# EAGLE schematic HDMI-LVDS (EAGLE 7.6.0)

## Sheet 1 of 3
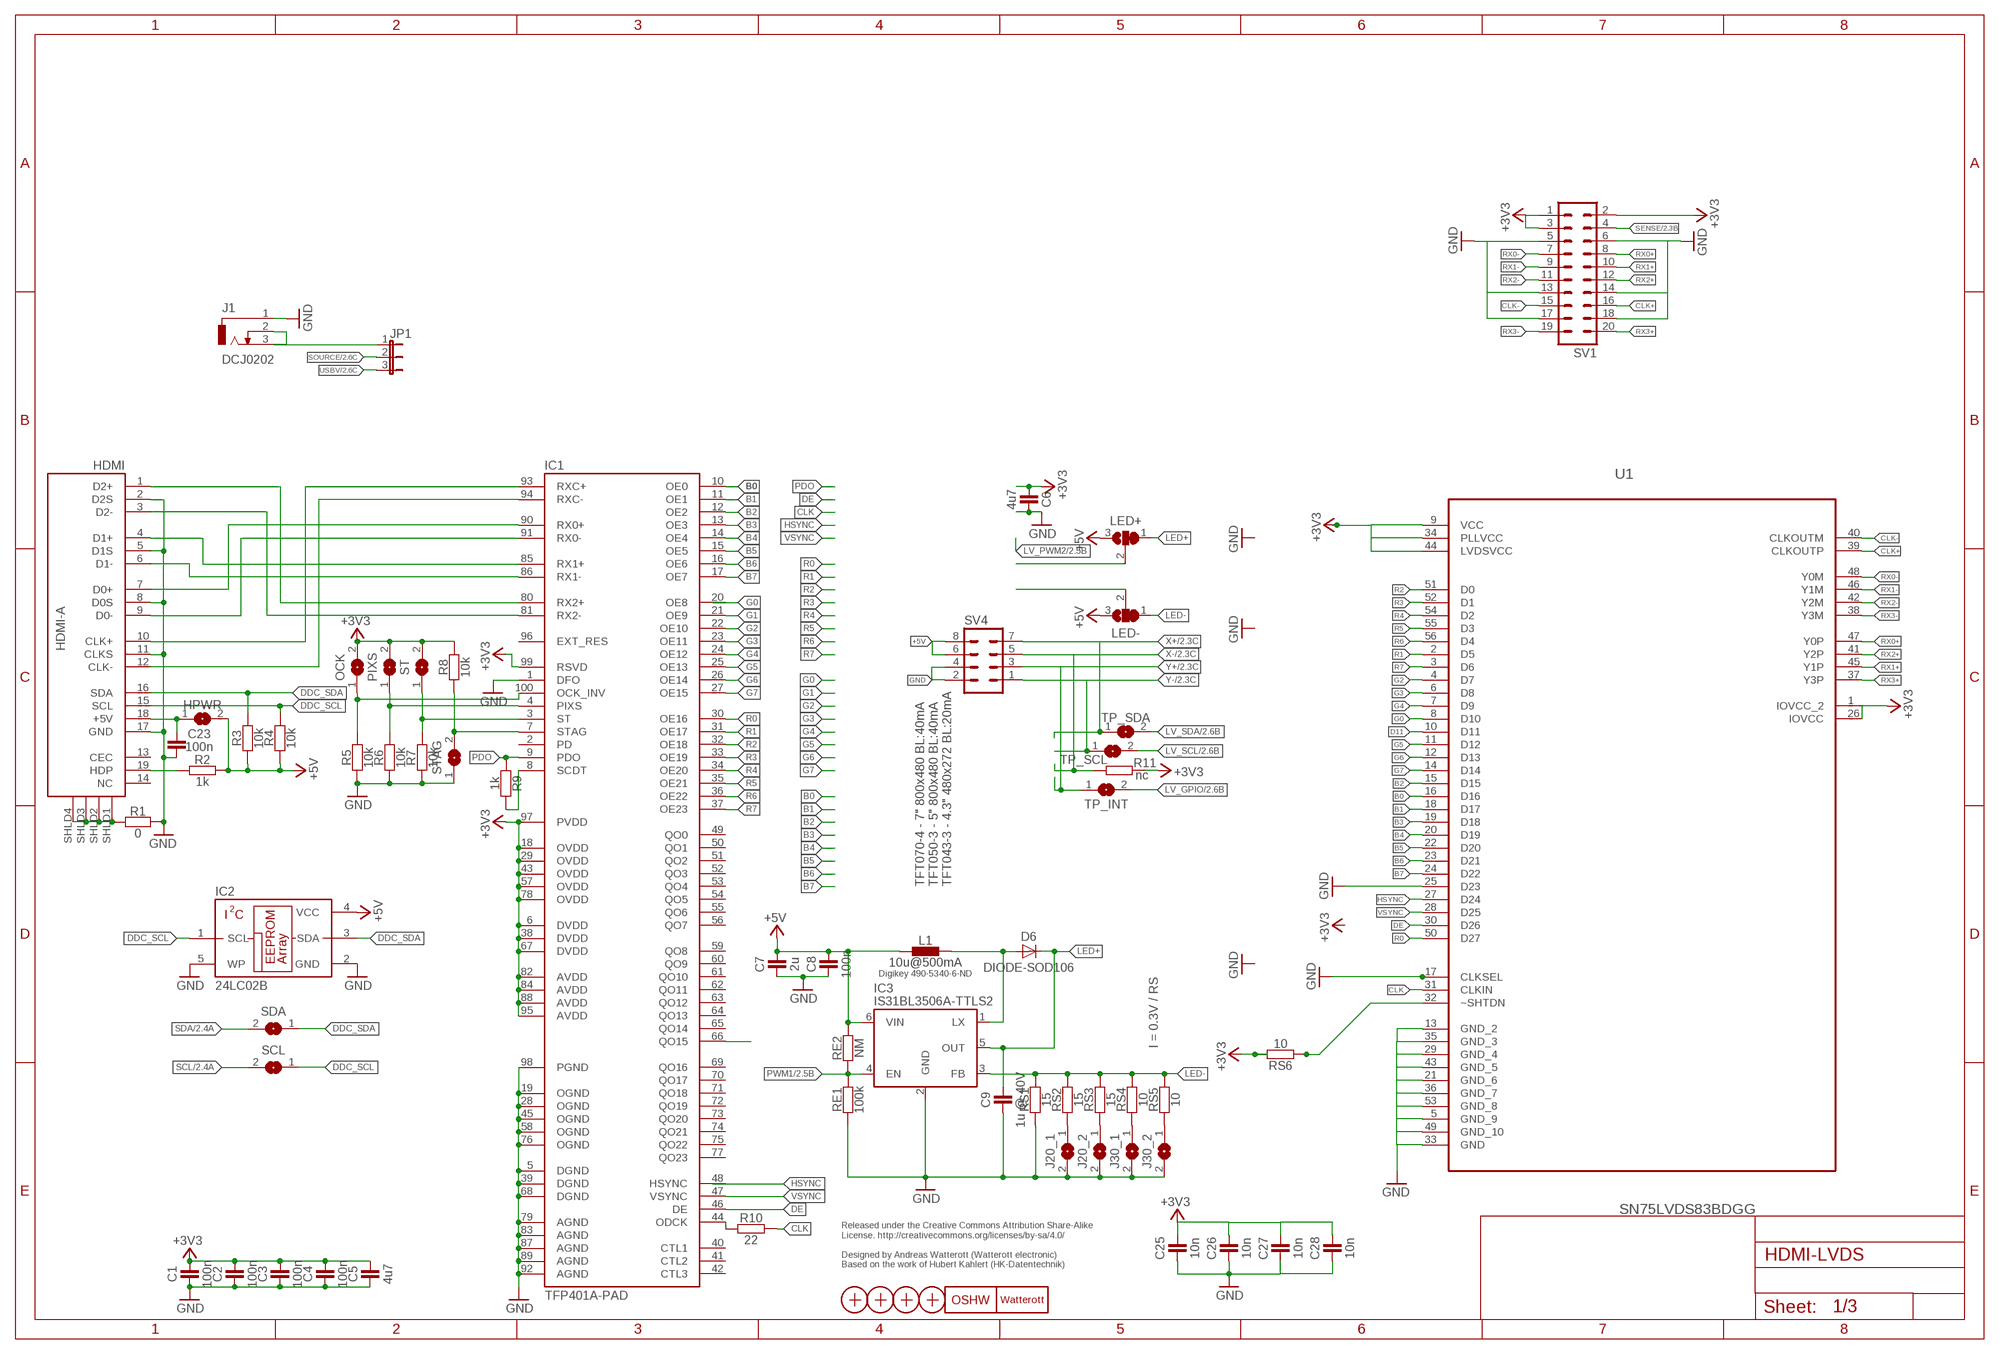
[diagram p0: schematic, sheet 1]

### Parts
C1  100n  CAPACITOR-0402  [C0402]
C2  100n  CAPACITOR-0402  [C0402]
C3  100n  CAPACITOR-0402  [C0402]
C4  100n  CAPACITOR-0402  [C0402]
C5  4u7  CAPACITOR-0402  [C0402]
C6  4u7  CAPACITOR-0402  [C0402]
C7  2u  CAPACITOR-0402  [C0402]
C8  100n  CAPACITOR-0402  [C0402]
C9  1u @ 40V  CAPACITOR-0805  [C0805]
C23  100n  CAPACITOR-0402  [C0402]
C25  10n  CAPACITOR-0402  [C0402]
C26  10n  CAPACITOR-0402  [C0402]
C27  10n  CAPACITOR-0402  [C0402]
C28  10n  CAPACITOR-0402  [C0402]
D6  DIODE-SOD106  [SOD106]
HDMI  HDMI-A  [HDMI_10029449]
HPWR  JUMPER2-0402  [JUMPER2-0402]
IC1  TFP401A-PAD  [TQFP100-PAD]
IC2  24LC02B  24LC-I/OT  [SOT23-5]
IC3  IS31BL3506A-TTLS2  [SOT23-6]
J1  DCJ0202  [DCJ0202]
J20_1  JUMPER2-0402  [JUMPER2-0402]
J20_2  JUMPER2-0402  [JUMPER2-0402]
J30_1  JUMPER2-0402  [JUMPER2-0402]
J30_2  JUMPER2-0402  [JUMPER2-0402]
JP1  JP2E  [JP2]
L1  10u@500mA  INDUCTOR-1212  [L_1212]
LED+  JUMPER3-0402  [JUMPER3-0402]
LED-  JUMPER3-0402  [JUMPER3-0402]
LOGO1  OSHW_LOGOX0070  [OSHW_6X70]
LOGO3  LOGO-S_PLACE_S  [SPARK_TPLACE_S]
OCK  JUMPER2-0201-NC  [JUMPER2-0201_NC]
PIXS  JUMPER2-0201-NC  [JUMPER2-0201_NC]
R1  0  RESISTOR-0402  [C0402]
R2  1k  RESISTOR-0402  [C0402]
R3  10k  RESISTOR-0402  [C0402]
R4  10k  RESISTOR-0402  [C0402]
R5  10k  RESISTOR-0402  [C0402]
R6  10k  RESISTOR-0402  [C0402]
R7  10k  RESISTOR-0402  [C0402]
R8  10k  RESISTOR-0402  [C0402]
R9  1k  RESISTOR-0402  [C0402]
R10  22  RESISTOR-0402  [C0402]
R11  nc  RESISTOR-0402  [C0402]
RE1  100k  RESISTOR-0402  [C0402]
RE2  NM  RESISTOR-0402  [C0402]
RS1  15  RESISTOR-0402  [C0402]
RS2  15  RESISTOR-0402  [C0402]
RS3  15  RESISTOR-0402  [C0402]
RS4  10  RESISTOR-0402  [C0402]
RS5  10  RESISTOR-0402  [C0402]
RS6  10  RESISTOR-0402  [C0402]
SCL  JUMPER2-0402  [JUMPER2-0402]
SDA  JUMPER2-0402  [JUMPER2-0402]
ST  JUMPER2-0201-NC  [JUMPER2-0201_NC]
STAG  JUMPER2-0201-NC  [JUMPER2-0201_NC]
SV1  MA10-2  [MA10-2]
SV4  MA04-2  [MA04-2]
TP_INT  JUMPER2-0402  [JUMPER2-0402]
TP_SCL  JUMPER2-0402  [JUMPER2-0402]
TP_SDA  JUMPER2-0402  [JUMPER2-0402]
U1  SN75LVDS83BDGG  [SOP50P810X120-56N]
X1  PASSER-07  [PASSER_07MM]
X2  PASSER-07  [PASSER_07MM]
X3  PASSER-07  [PASSER_07MM]
X4  PASSER-07  [PASSER_07MM]

### Nets
+3V3: C1.2 C2.2 C3.2 C4.2 C5.2 C6.1 C25.2 C26.2 C27.2 C28.2 IC1.6(DVDD) IC1.18(OVDD) IC1.29(OVDD) IC1.38(DVDD) IC1.43(OVDD) IC1.57(OVDD) IC1.67(DVDD) IC1.78(OVDD) IC1.82(AVDD) IC1.84(AVDD) IC1.88(AVDD) IC1.95(AVDD) IC1.97(PVDD) IC1.99(RSVD) OCK.2 PIXS.2 R8.2 R11.2 RS6.2 ST.2 SV1.1 SV1.2 SV1.3 U1.1(IOVCC_2) U1.9(VCC) U1.26(IOVCC) U1.34(PLLVCC) U1.44(LVDSVCC) ; also sheet 2
+5V: C7.2 C8.2 HPWR.2 IC2.4(VCC) IC3.6(VIN) L1.1 LED+.3 LED-.3 R2.2 R3.1 R4.1 RE2.2 SV4.6 SV4.8 ; also sheet 2
B0: IC1.10(OE0) U1.16(D16)
B1: IC1.11(OE1) U1.18(D17)
B2: IC1.12(OE2) U1.15(D15)
B3: IC1.13(OE3) U1.19(D18)
B4: IC1.14(OE4) U1.20(D19)
B5: IC1.15(OE5) U1.22(D20)
B6: IC1.16(OE6) U1.23(D21)
B7: IC1.17(OE7) U1.24(D22)
CLK: R10.2 U1.31(CLKIN)
CLK+: SV1.16 U1.39(CLKOUTP)
CLK-: SV1.15 U1.40(CLKOUTM)
CLK_N: HDMI.12(CLK-) IC1.94(RXC-)
CLK_P: HDMI.10(CLK+) IC1.93(RXC+)
D0_N: HDMI.9(D0-) IC1.91(RX0-)
D0_P: HDMI.7(D0+) IC1.90(RX0+)
D1_N: HDMI.6(D1-) IC1.86(RX1-)
D1_P: HDMI.4(D1+) IC1.85(RX1+)
D2_N: HDMI.3(D2-) IC1.81(RX2-)
D2_P: HDMI.1(D2+) IC1.80(RX2+)
D11: U1.10(D11)
DDC_SCL: HDMI.15(SCL) IC2.1(SCL) R4.2 SCL.1
DDC_SDA: HDMI.16(SDA) IC2.3(SDA) R3.2 SDA.1
DE: IC1.46(DE) U1.30(D26)
G0: IC1.20(OE8) U1.8(D10)
G1: IC1.21(OE9)
G2: IC1.22(OE10) U1.4(D7)
G3: IC1.23(OE11) U1.6(D8)
G4: IC1.24(OE12) U1.7(D9)
G5: IC1.25(OE13) U1.11(D12)
G6: IC1.26(OE14) U1.12(D13)
G7: IC1.27(OE15) U1.14(D14)
GND: C1.1 C2.1 C3.1 C4.1 C5.1 C6.2 C7.1 C8.1 C9.1 C23.1 C25.1 C26.1 C27.1 C28.1 HDMI.2(D2S) HDMI.5(D1S) HDMI.8(D0S) HDMI.11(CLKS) HDMI.17(GND) IC1.1(DFO) IC1.5(DGND) IC1.19(OGND) IC1.28(OGND) IC1.39(DGND) IC1.45(OGND) IC1.58(OGND) IC1.68(DGND) IC1.76(OGND) IC1.79(AGND) IC1.83(AGND) IC1.87(AGND) IC1.89(AGND) IC1.92(AGND) IC1.98(PGND) IC2.2(GND) IC2.5(WP) IC3.2(GND) J1.1 J20_1.2 J20_2.2 J30_1.2 J30_2.2 R1.1 R5.1 R6.1 R7.1 RE1.1 RS1.1 STAG.1 SV1.5 SV1.6 SV1.13 SV1.14 SV1.17 SV1.18 SV4.2 SV4.4 U1.5(GND_9) U1.13(GND_2) U1.21(GND_6) U1.25(D23) U1.29(GND_4) U1.33(GND) U1.35(GND_3) U1.36(GND_7) U1.43(GND_5) U1.49(GND_10) U1.53(GND_8) ; also sheet 2
HDMI_5V: C23.2 HDMI.18(+5V) HPWR.1
HDMI_DECT: HDMI.19(HDP) R2.1
HSYNC: IC1.48(HSYNC) U1.27(D24)
LED+: C9.2 D6.C IC3.5(OUT) LED+.1
LED-: IC3.3(FB) LED-.1 RS1.2 RS2.2 RS3.2 RS4.2 RS5.2
LEDA: LED+.2
LEDC: LED-.2
LV_GPIO: TP_INT.2 ; also sheet 2
LV_SCL: TP_SCL.2 ; also sheet 2
LV_SDA: TP_SDA.2 ; also sheet 2
LX: D6.A IC3.1(LX) L1.2
N$1: J20_2.1 RS3.1
N$3: IC1.44(ODCK) R10.1
N$4: J30_1.1 RS4.1
N$5: J20_1.1 RS2.1
N$7: J30_2.1 RS5.1
N$10: J1.2 J1.3 JP1.1
N$11: RS6.1 U1.32(~SHTDN)
N$12: U1.17(CLKSEL)
N$19: IC1.66(QO15)
OCKINV: IC1.100(OCK_INV) OCK.1 R5.2
PDO: IC1.9(PDO) R9.1
PIXS: IC1.4(PIXS) PIXS.1 R6.2
PWM1: IC3.4(EN) RE1.2 RE2.1 ; also sheet 2
R0: IC1.30(OE16) U1.50(D27)
R1: IC1.31(OE17) U1.2(D5)
R2: IC1.32(OE18) U1.51(D0)
R3: IC1.33(OE19) U1.52(D1)
R4: IC1.34(OE20) U1.54(D2)
R5: IC1.35(OE21) U1.55(D3)
R6: IC1.36(OE22) U1.56(D4)
R7: IC1.37(OE23) U1.3(D6)
RX0+: SV1.8 U1.47(Y0P)
RX0-: SV1.7 U1.48(Y0M)
RX1+: SV1.10 U1.45(Y1P)
RX1-: SV1.9 U1.46(Y1M)
RX2+: SV1.12 U1.41(Y2P)
RX2-: SV1.11 U1.42(Y2M)
RX3+: SV1.20 U1.37(Y3P)
RX3-: SV1.19 U1.38(Y3M)
SCDT: IC1.8(SCDT) R9.2
SCL: SCL.2 ; also sheet 2
SDA: SDA.2 ; also sheet 2
SENSE: SV1.4 ; also sheet 2
SHLD3: HDMI.SHLD1(SHLD) HDMI.SHLD2(SHLD) HDMI.SHLD3(SHLD) HDMI.SHLD4(SHLD) R1.2
SOURCE: JP1.2 ; also sheet 2
ST: IC1.3(ST) R7.2 ST.1
STAG: IC1.7(STAG) R8.1 STAG.2
USBV: JP1.3 ; also sheet 2
VSYNC: IC1.47(VSYNC) U1.28(D25)
X+: SV4.7 TP_SDA.1 ; also sheet 2
X-: R11.1 SV4.5 ; also sheet 2
Y+: SV4.3 TP_INT.1 ; also sheet 2
Y-: SV4.1 TP_SCL.1 ; also sheet 2
Unconnected: HDMI.13(CEC) HDMI.14(NC) IC1.2(PD) IC1.40(CTL1) IC1.41(CTL2) IC1.42(CTL3) IC1.49(QO0) IC1.50(QO1) IC1.51(QO2) IC1.52(QO3) IC1.53(QO4) IC1.54(QO5) IC1.55(QO6) IC1.56(QO7) IC1.59(QO8) IC1.60(QO9) IC1.61(QO10) IC1.62(QO11) IC1.63(QO12) IC1.64(QO13) IC1.65(QO14) IC1.69(QO16) IC1.70(QO17) IC1.71(QO18) IC1.72(QO19) IC1.73(QO20) IC1.74(QO21) IC1.75(QO22) IC1.77(QO23) IC1.96(EXT_RES)

### Notes on the sheet
- TFT070-4 - 7" 800x480 BL:40mA
  TFT050-3 - 5" 800x480 BL:40mA
  TFT043-3 - 4.3" 480x272 BL:20mA
- Digikey 490-5340-6-ND
- I = 0.3V / RS
- Released under the Creative Commons Attribution Share-Alike 
  License. http://creativecommons.org/licenses/by-sa/4.0/
  
  Designed by Andreas Watterott (Watterott electronic)
  Based on the work of Hubert Kahlert (HK-Datentechnik)

## Sheet 2 of 3
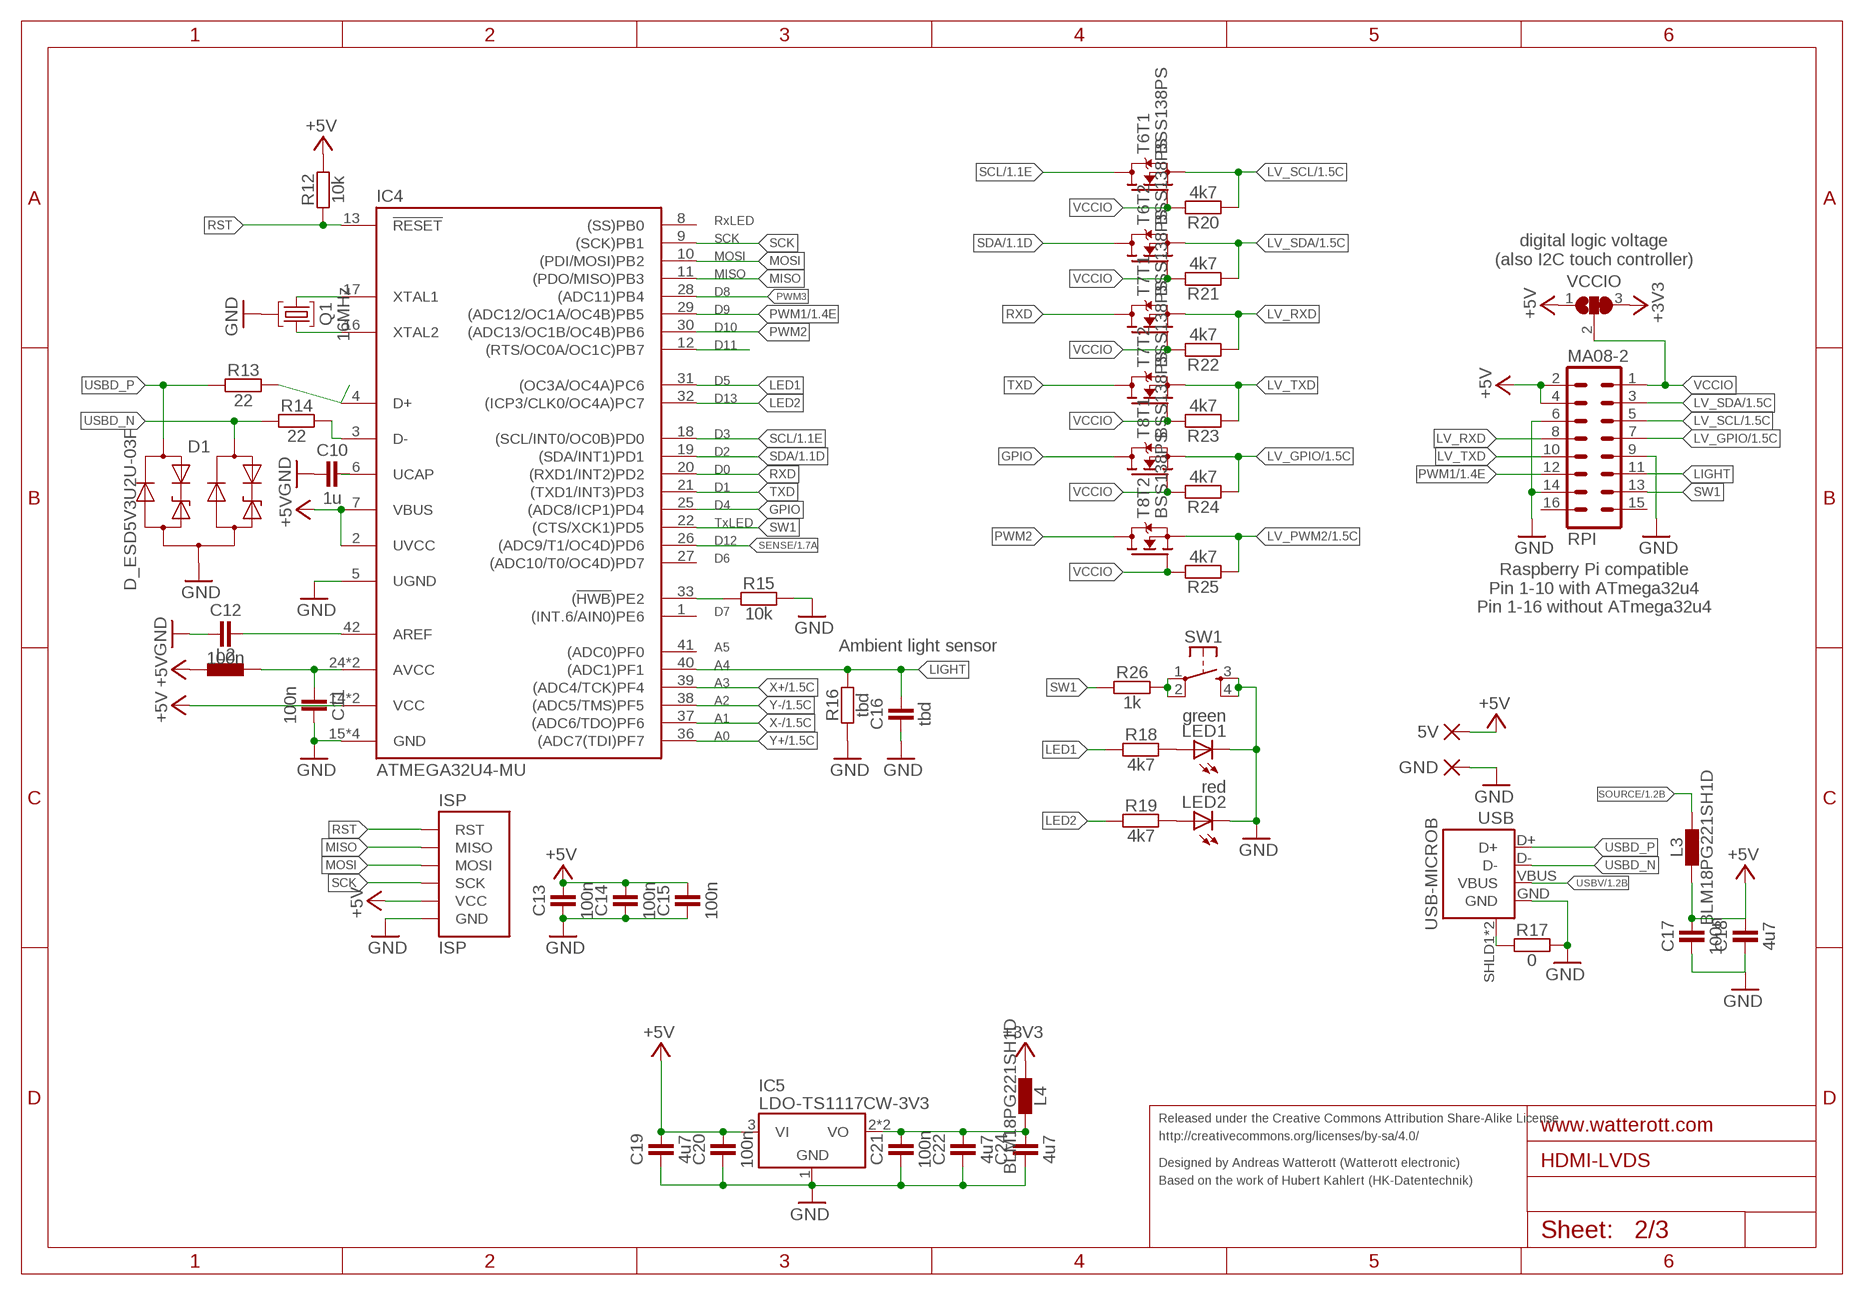
[diagram p1: schematic, sheet 2]

### Parts
5V  PAD-1.27X2.54_NC  [PAD-1.27X2.54_NC]
C10  1u  CAPACITOR-0402  [C0402]
C11  100n  CAPACITOR-0402  [C0402]
C12  100n  CAPACITOR-0402  [C0402]
C13  100n  CAPACITOR-0402  [C0402]
C14  100n  CAPACITOR-0402  [C0402]
C15  100n  CAPACITOR-0402  [C0402]
C16  tbd  CAPACITOR-0402  [C0402]
C17  100n  CAPACITOR-0402  [C0402]
C18  4u7  CAPACITOR-0402  [C0402]
C19  4u7  CAPACITOR-0402  [C0402]
C20  100n  CAPACITOR-0402  [C0402]
C21  100n  CAPACITOR-0402  [C0402]
C22  4u7  CAPACITOR-0402  [C0402]
C24  4u7  CAPACITOR-0402  [C0402]
D1  D_ESD5V3U2U-03F  [SOT723]
GND  PAD-1.27X2.54_NC  [PAD-1.27X2.54_NC]
IC4  ATMEGA32U4-MU  [QFN44]
IC5  LDO-TS1117CW-3V3  [SOT223]
ISP  ISP  [ISP-2X3]
L2  INDUCTOR-0603  [C0603]
L3  BLM18PG221SH1D  INDUCTOR-0603  [C0603]
L4  BLM18PG221SH1D  INDUCTOR-0603  [C0603]
LED1  green  LED-0603  [C0603]
LED2  red  LED-0603  [C0603]
Q1  16MHz  CRYSTAL-RES-32  [CRYSTAL_32X13]
R12  10k  RESISTOR-0402  [C0402]
R13  22  RESISTOR-0402  [C0402]
R14  22  RESISTOR-0402  [C0402]
R15  10k  RESISTOR-0402  [C0402]
R16  tbd  RESISTOR-0402  [C0402]
R17  0  RESISTOR-0402  [C0402]
R18  4k7  RESISTOR-0402  [C0402]
R19  4k7  RESISTOR-0402  [C0402]
R20  4k7  RESISTOR-0402  [C0402]
R21  4k7  RESISTOR-0402  [C0402]
R22  4k7  RESISTOR-0402  [C0402]
R23  4k7  RESISTOR-0402  [C0402]
R24  4k7  RESISTOR-0402  [C0402]
R25  4k7  RESISTOR-0402  [C0402]
R26  1k  RESISTOR-0402  [C0402]
RPI  MA08-2  [MA08-2]
SW1  SW-TACTILE-PTS840P  [PTS840P]
T6  BSS138PS  [SOT363]
T7  BSS138PS  [SOT363]
T8  BSS138PS  [SOT363]
USB  USB-MICROB  [USB-MICROB-10103594]
VCCIO  JUMPER3-0402  [JUMPER3-0402]

### Nets
3VOUT: C21.2 C22.2 C24.2 IC5.2(VO) IC5.4(VO) L4.2
+3V3: L4.1 VCCIO.3 ; also sheet 1
+5V: 5V.1(P) C13.2 C14.2 C15.2 C17.2 C18.2 C19.2 C20.2 IC4.2(UVCC) IC4.7(VBUS) IC4.14(VCC) IC4.34(VCC) IC5.3(VI) ISP.VCC L2.1 L3.1 R12.2 RPI.2 RPI.4 VCCIO.1 ; also sheet 1
AREF: C12.2 IC4.42(AREF)
AVCC: C11.1 IC4.24(AVCC) IC4.44(AVCC) L2.2
D_N: IC4.3(D-) R14.2
D_P: IC4.4(D+) R13.2
GND: C10.1 C11.2 C12.1 C13.1 C14.1 C15.1 C16.1 C17.1 C18.1 C19.1 C20.1 C21.1 C22.1 C24.1 D1.3(A) GND.1(P) IC4.5(UGND) IC4.15(GND) IC4.23(GND) IC4.35(GND) IC4.43(GND) IC5.1(GND) ISP.GND LED1.C LED2.C Q1.GND R15.2 R16.1 R17.1 RPI.6 RPI.9 RPI.14 SW1.3(S1) SW1.4(S2) USB.GND ; also sheet 1
GPIO: IC4.25((ADC8/ICP1)PD4) T8.6(T1:D)
HWB: IC4.33((!HWB!)PE2) R15.1
LED1: IC4.31((OC3A/OC4A)PC6) R18.1
LED2: IC4.32((ICP3/CLK0/OC4A)PC7) R19.1
LIGHT: C16.2 IC4.40((ADC1)PF1) R16.2 RPI.11
LV_GPIO: R24.1 RPI.7 T8.1(T1:S) ; also sheet 1
LV_PWM2: R25.1 T8.4(T2:S) ; also sheet 1
LV_RXD: R22.1 RPI.8 T7.1(T1:S)
LV_SCL: R20.1 RPI.5 T6.1(T1:S) ; also sheet 1
LV_SDA: R21.1 RPI.3 T6.4(T2:S) ; also sheet 1
LV_TXD: R23.1 RPI.10 T7.4(T2:S)
MISO: IC4.11((PDO/MISO)PB3) ISP.MISO
MOSI: IC4.10((PDI/MOSI)PB2) ISP.MOSI
N$6: R26.2 SW1.1 SW1.2
N$9: IC4.12((RTS/OC0A/OC1C)PB7)
N$17: LED1.A R18.2
N$18: LED2.A R19.2
PWM1: IC4.29((ADC12/OC1A/OC4B)PB5) RPI.12 ; also sheet 1
PWM2: IC4.30((ADC13/OC1B/OC4B)PB6) T8.3(T2:D)
PWM3: IC4.28((ADC11)PB4)
RST: IC4.13(!RESET) ISP.RST R12.1
RXD: IC4.20((RXD1/INT2)PD2) T7.6(T1:D)
SCK: IC4.9((SCK)PB1) ISP.SCK
SCL: IC4.18((SCL/INT0/OC0B)PD0) T6.6(T1:D) ; also sheet 1
SDA: IC4.19((SDA/INT1)PD1) T6.3(T2:D) ; also sheet 1
SENSE: IC4.26((ADC9/T1/OC4D)PD6) ; also sheet 1
SHLD1: R17.2 USB.SHLD1(SHIELD) USB.SHLD2(SHIELD)
SOURCE: L3.2 ; also sheet 1
SW1: IC4.22((CTS/XCK1)PD5) R26.1 RPI.13
TXD: IC4.21((TXD1/INT3)PD3) T7.3(T2:D)
UCAP: C10.2 IC4.6(UCAP)
USBD_N: D1.2(C2) R14.1 USB.D-
USBD_P: D1.1(C1) R13.1 USB.D+
USBV: USB.VBUS ; also sheet 1
VCCIO: R20.2 R21.2 R22.2 R23.2 R24.2 R25.2 RPI.1 T6.2(T1:G) T6.5(T2:G) T7.2(T1:G) T7.5(T2:G) T8.2(T1:G) T8.5(T2:G) VCCIO.2
X+: IC4.39((ADC4/TCK)PF4) ; also sheet 1
X-: IC4.37((ADC6/TDO)PF6) ; also sheet 1
XTAL1: IC4.17(XTAL1) Q1.2
XTAL2: IC4.16(XTAL2) Q1.1
Y+: IC4.36((ADC7(TDI)PF7) ; also sheet 1
Y-: IC4.38((ADC5/TMS)PF5) ; also sheet 1
Unconnected: IC4.1((INT.6/AIN0)PE6) IC4.8((SS)PB0) IC4.27((ADC10/T0/OC4D)PD7) IC4.41((ADC0)PF0) RPI.15 RPI.16

### Notes on the sheet
- RxLED
- digital logic voltage
  (also I2C touch controller)
- SCK
- MOSI
- MISO
- D8
- D9
- D10
- D11
- D5
- D13
- D3
- D2
- D0
- D1
- D4
- TxLED
- D12
- D6
- Raspberry Pi compatible
  Pin 1-10 with ATmega32u4
  Pin 1-16 without ATmega32u4
- D7
- A5 | Ambient light sensor
- A4
- A3
- A2
- A1
- A0
- Released under the Creative Commons Attribution Share-Alike License
- http://creativecommons.org/licenses/by-sa/4.0/
- Designed by Andreas Watterott (Watterott electronic)
- Based on the work of Hubert Kahlert (HK-Datentechnik)

## Sheet 3 of 3
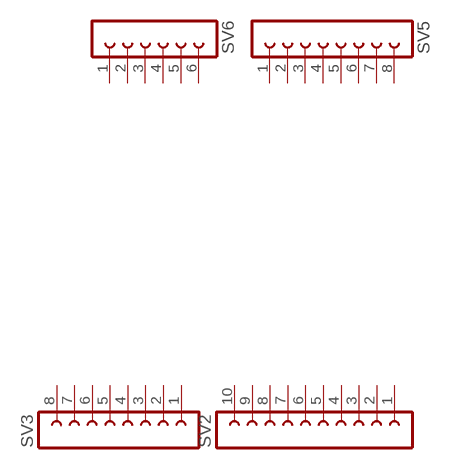
[diagram p2: schematic, sheet 3]

### Parts
SV2  FE10-1  [FE10]
SV3  FE08-1  [FE08]
SV5  FE08-1  [FE08]
SV6  FE06-1  [FE06]
Unconnected: SV2.1 SV2.2 SV2.3 SV2.4 SV2.5 SV2.6 SV2.7 SV2.8 SV2.9 SV2.10 SV3.1 SV3.2 SV3.3 SV3.4 SV3.5 SV3.6 SV3.7 SV3.8 SV5.1 SV5.2 SV5.3 SV5.4 SV5.5 SV5.6 SV5.7 SV5.8 SV6.1 SV6.2 SV6.3 SV6.4 SV6.5 SV6.6

## Library data of the parts
5V GND = we-rcl:PAD: Pads
C1-C28 = we-rcl:CAPACITOR: Capacitors ...4.7uF @ 6.3V -> 0402 ...10uF @ 16V -> 0603 ...22uF @ 25V -> 0805
D1 = we-rcl:D_ESD5V3U2U: TVS Diode - Uni-directional Ultra Low ESD / Transient Protection Diode (0.4pF@1MHz, 5V); DIGIKEY: ESD5V3U2U-03F H6327DKR-ND
D6 = we-rcl:DIODE: Diodes
HDMI = we-con:HDMI: HDMI Connectors; DIGIKEY: 609-4614-2-ND
HPWR J20_1 J20_2 J30_1 J30_2 OCK PIXS SCL SDA ST STAG TP_INT TP_SCL TP_SDA = we-rcl:JUMPER2: 2 Pin Jumpers
IC1 = we-chip:TFP401A: TI TFP401A HDMI/DVI Receiver; DIGIKEY: 296-9987-ND
IC2 = we-chip:24LC*: Microchip I2C EEPROM 2 Kbit - 24LC02B - 24LC02BT-I/OTDKR-ND 32 Kbit- 24LC32A - 24LC32AT-I/OTDKR-ND; DIGIKEY: 24LC32AT-I/OTDKR-ND
IC3 = we-power:IS31BL3506A: ISSI IS31BL3506A Boost Converter for LED Backlight Input: 2.7...5V Output: up to 35V 300mV Feedback Voltage; DIGIKEY: 706-1213-6-ND
IC4 = we-chip:ATMEGA32U4: Atmel ATmega16U4/32U4 AVR Microcontroller
IC5 = we-power:LDO: LDOs TS1117 800mA max 16V - compatible AP1117 1A max 18V, NCP1117 1A max 20V TS9011 250mA max 12V - compatible AP2210 300mA max 15V TS5204 150mA max 16V
ISP = we-board:ISP: AVR ISP 6pol connector
J1 = con-jack:DCJ0202: DC POWER JACK Source: DCJ0202.pdf; OC_FARNELL: unknown; OC_NEWARK: unknown
JP1 = jumper:JP2E: JUMPER
L1 = we-power:INDUCTOR: Power Inductors Taiyo Yuden NR6028 NR6028T1R5N - 1.5uH, 16mOhm, Ir=5.00A NR6028T2R2N - 2.2uH, 20mOhm, Ir=4.20A NR6028T3R0N - 3.0uH, 23mOhm, Ir=3.60A NR6028T4R7M - 4.7uH, 31mOhm, Ir=2.70A NR6028T6R0M - 6.0uH, 40mOhm, Ir=2.50A NR6028T100M - 10uH, 65mOhm, Ir=1.90A NR6028T150M - 15uH, 95mOhm, Ir=1.60A NR6028T220M - 22uH, 135mOhm, Ir=1.30A NR6028T330M - 33uH, 220mOhm, Ir=1.10A NR6028T470M - 47uH, 300mOhm, Ir=0.95A NR6028T680M - 68uH, 420mOhm, Ir=0.76A NR6028T101M - 100uH, 600mOhm, Ir=0.62A
L2-L4 = we-rcl:INDUCTOR: Inductors Ferrite Bead 0603 1.4A 220Ohm @ 100MH, -> Murata BLM18PG221SH1D 0603 1.0A 20Ohm @ 100MH -> Murata BLM18PG300SN1D
LED1 LED2 = we-opto:LED: LEDs red, green, blue -> 0603
LED+ LED- VCCIO = we-rcl:JUMPER3: 3 Pin Jumpers
LOGO1 = we-symbol:OSHW_LOGO: Open-Source-Hardware Logo
LOGO3 = we-symbol:LOGO: Watterott electronic Logo
Q1 = we-rcl:CRYSTAL-RES: Crystal Resonators 8MHz and 16MHz -> 32x13
R1-R26 RE1 RE2 RS1-RS6 = we-rcl:RESISTOR: Resistors all kinds in 0603 and 0402
RPI = we-con:MA08-2: Pin Header
SV1 = con-lstb:MA10-2: PIN HEADER; OC_FARNELL: unknown; OC_NEWARK: unknown
SV2 = con-lsta:FE10-1: FEMALE HEADER; OC_FARNELL: unknown; OC_NEWARK: unknown
SV3 SV5 = con-lsta:FE08-1: FEMALE HEADER; OC_FARNELL: unknown; OC_NEWARK: unknown
SV4 = con-lstb:MA04-2: PIN HEADER; OC_FARNELL: unknown; OC_NEWARK: unknown
SV6 = con-lsta:FE06-1: FEMALE HEADER; OC_FARNELL: unknown; OC_NEWARK: unknown
SW1 = we-switch:SW-TACTILE: Tactile Switches; DIGIKEY: CKN10511DKR-ND
T6-T8 = we-transistor:BSS138PS: BSS138 Dual N-Channel MOSFET (UGS +/-20V, RDS 1Ohm, ID 320mA)
U1 = Texas Instruments_By_element14_Batch_1:SN75LVDS83BDGG: FLATLINK? TRANSMITTER; MPN: SN75LVDS83BDGG; OC_FARNELL: 1786537; OC_NEWARK: 11R7398; PACKAGE: TSSOP-56; SUPPLIER: Texas Instruments
USB = we-con:USB: USB Connectors; DIGIKEY: 609-4050-6-ND
X1-X4 = we-symbol:PASSER: Fiducial Markers

## Net classes
0 default: clearance 0.5 mm